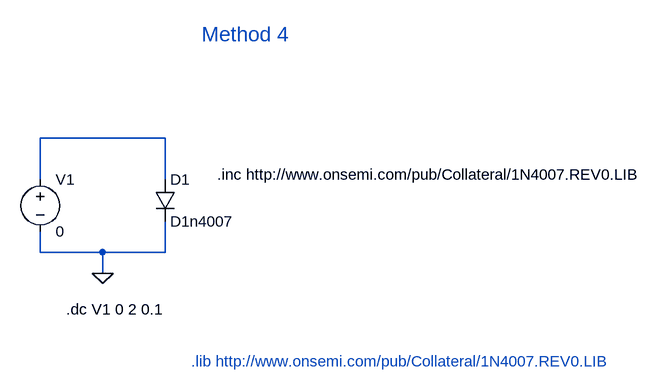
[diagram p0: schematic LTspice 06-1 Import SPICE model_method4 url.asc]
LTspice 06-1 Import SPICE model_method4 url.asc, the LTspice schematic file:
Version 4
SHEET 1 2548 680
WIRE 1728 -224 1536 -224
WIRE 1536 -160 1536 -224
WIRE 1728 -160 1728 -224
WIRE 1536 -48 1536 -80
WIRE 1632 -48 1536 -48
WIRE 1728 -48 1728 -96
WIRE 1728 -48 1632 -48
WIRE 1632 -16 1632 -48
FLAG 1632 -16 0
SYMBOL voltage 1536 -176 R0
SYMATTR InstName V1
SYMATTR Value 0
SYMBOL diode 1712 -160 R0
SYMATTR InstName D1
SYMATTR Value D1n4007
TEXT 1576 40 Left 2 !.dc V1 0 2 0.1
TEXT 1784 -384 Left 3 ;Method 4
TEXT 1768 120 Left 2 ;.lib http://www.onsemi.com/pub/Collateral/1N4007.REV0.LIB
TEXT 1808 -168 Left 2 !.inc http://www.onsemi.com/pub/Collateral/1N4007.REV0.LIB

The netlist it stands for:
* LTspice 06-1 Import SPICE model_method4 url.asc
V1 N001 0 0
D1 N001 0 D1n4007
.model D D
.lib standard.dio
.dc V1 0 2 0.1
* Method 4
* .lib http://www.onsemi.com/pub/Collateral/1N4007.REV0.LIB
.inc http://www.onsemi.com/pub/Collateral/1N4007.REV0.LIB
.backanno
.end